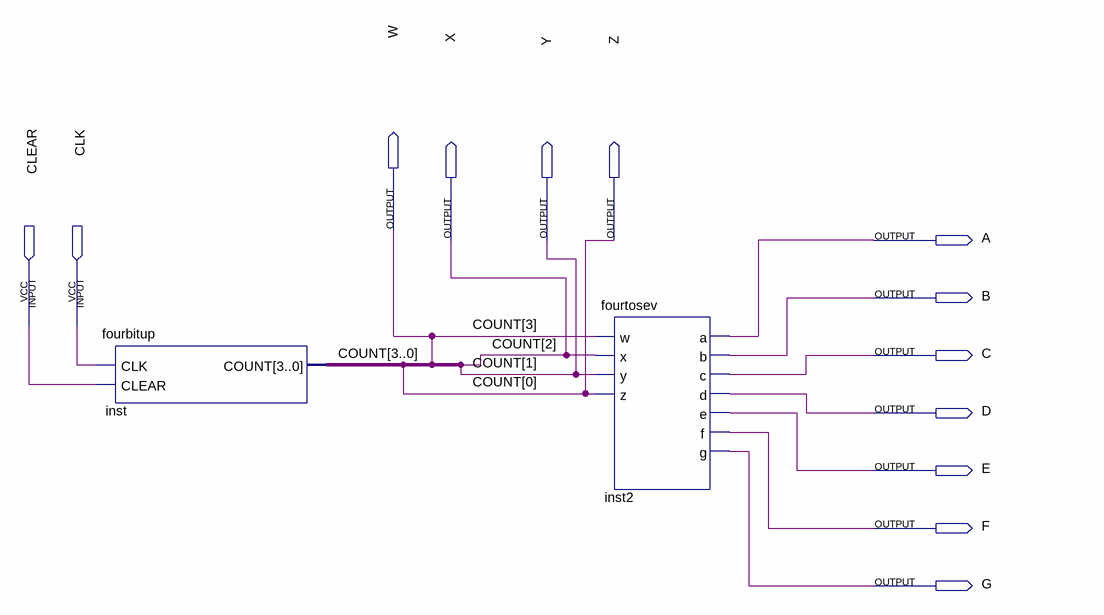
[diagram p0: schematic sheet]
// Quartus schematic singleseg.bdf as structural Verilog: 2 symbols, 13 pins
module singleseg (
  input  CLEAR,
  input  CLK,
  output W,
  output X,
  output Y,
  output Z,
  output A,
  output B,
  output C,
  output D,
  output E,
  output F,
  output G
);

  fourbitup inst (.CLK(CLK), .CLEAR(CLEAR), .COUNT({W, X, Y, Z}));
  fourtosev inst2 (.w(W), .x(X), .y(Y), .z(Z), .a(A), .b(B), .c(C), .d(D), .e(E), .f(F), .g(G));

  // Other names for the same wires on the sheet: COUNT[3:0] = {W, X, Y, Z}
endmodule
